# EAGLE schematic lm709_discrete (EAGLE 9.5.2)

## Sheet 1 of 2
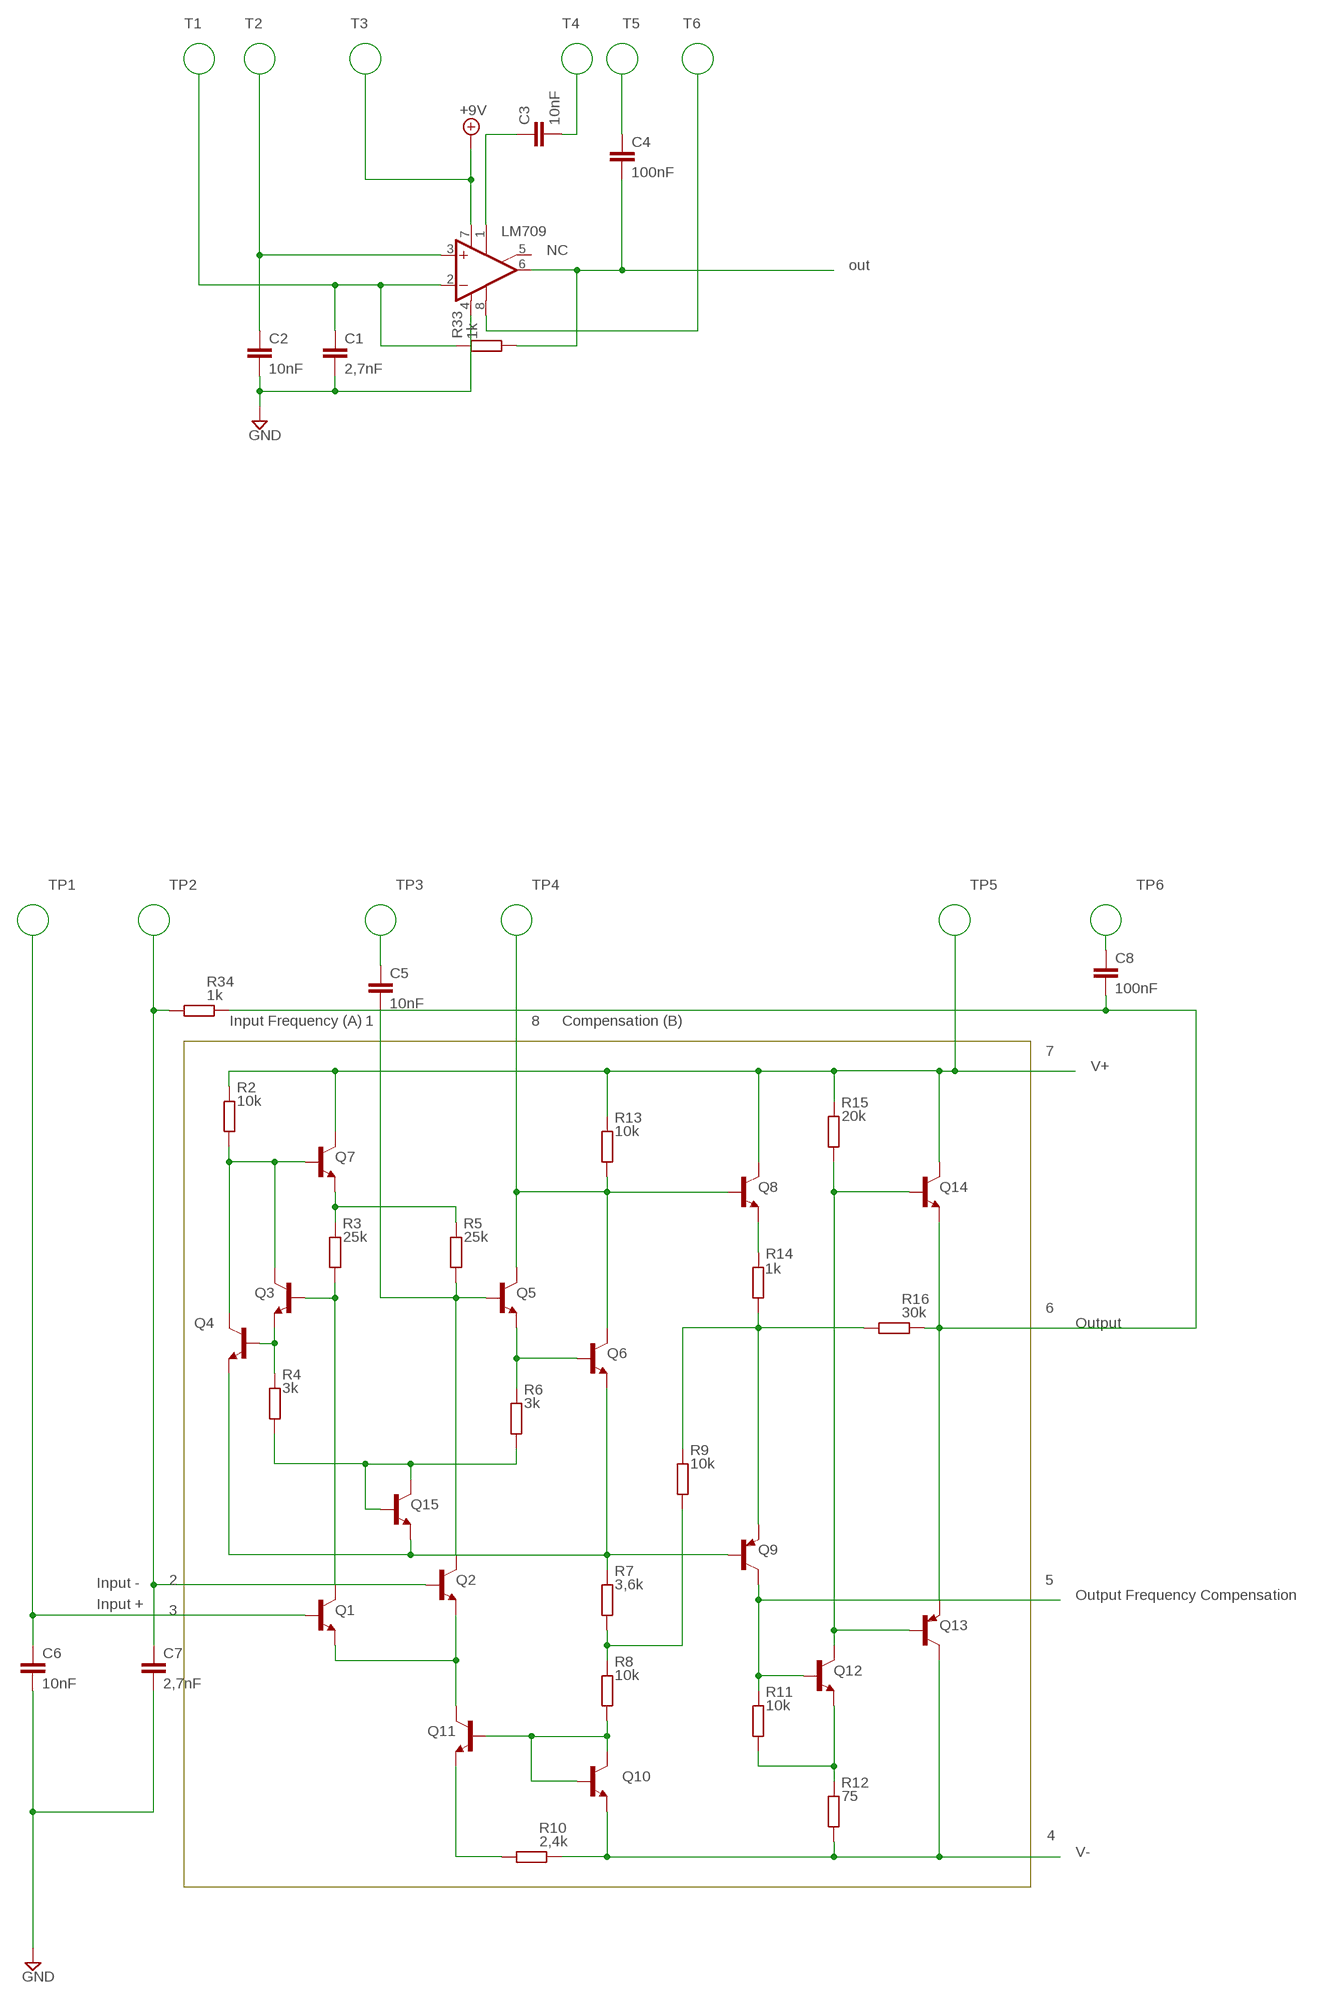
[diagram p0: schematic, sheet 1]

### Parts
C1  2,7nF  C-EU025-024X044  [C025-024X044]
C2  10nF  C-EU025-024X044  [C025-024X044]
C3  10nF  C-EU025-024X044  [C025-024X044]
C4  100nF  C-EU025-024X044  [C025-024X044]
C5  10nF  C-EU025-024X044  [C025-024X044]
C6  10nF  C-EU025-024X044  [C025-024X044]
C7  2,7nF  C-EU025-024X044  [C025-024X044]
C8  100nF  C-EU025-024X044  [C025-024X044]
LM709  LM741P  [DIL08]
Q1  2N3904  [TO92]
Q2  2N3904  [TO92]
Q3  2N3904  [TO92]
Q4  2N3904  [TO92]
Q5  2N3904  [TO92]
Q6  2N3904  [TO92]
Q7  2N3904  [TO92]
Q8  2N3904  [TO92]
Q9  2N3906  [TO92]
Q10  2N3904  [TO92]
Q11  2N3904  [TO92]
Q12  2N3904  [TO92]
Q13  2N3906  [TO92]
Q14  2N3904  [TO92]
Q15  2N3904  [TO92]
R2  10k  R-EU_0207/10  [0207/10]
R3  25k  R-EU_0207/10  [0207/10]
R4  3k  R-EU_0207/10  [0207/10]
R5  25k  R-EU_0207/10  [0207/10]
R6  3k  R-EU_0207/10  [0207/10]
R7  3,6k  R-EU_0207/10  [0207/10]
R8  10k  R-EU_0207/10  [0207/10]
R9  10k  R-EU_0207/10  [0207/10]
R10  2,4k  R-EU_0207/10  [0207/10]
R11  10k  R-EU_0207/10  [0207/10]
R12  75  R-EU_0207/10  [0207/10]
R13  10k  R-EU_0207/10  [0207/10]
R14  1k  R-EU_0207/10  [0207/10]
R15  20k  R-EU_0207/10  [0207/10]
R16  30k  R-EU_0207/10  [0207/10]
R33  1k  R-EU_0207/10  [0207/10]
R34  1k  R-EU_0207/10  [0207/10]

### Nets
+9V: LM709.7(V+)
GND: C1.2 C2.2 C6.2 C7.2 LM709.4(V-)
N$1: Q3.3(E) Q4.2(B) R4.2
N$2: Q1.1(C) Q3.2(B) R3.1
N$3: Q7.3(E) R3.2 R5.2
N$4: Q3.1(C) Q4.1(C) Q7.2(B) R2.1
N$5: Q7.1(C) Q8.1(C) Q14.1(C) R2.2 R13.2 R15.2
N$6: Q5.3(E) Q6.2(B) R6.2
N$7: C5.2 Q2.1(C) Q5.2(B) R5.1
N$8: Q15.1(C) Q15.2(B) R4.1 R6.1
N$9: Q4.3(E) Q6.3(E) Q9.2(B) Q15.3(E) R7.2
N$10: Q12.1(C) Q13.2(B) Q14.2(B) R15.1
N$11: C6.1 Q1.2(B)
N$12: C7.1 Q2.2(B) R34.2
N$13: Q1.3(E) Q2.3(E) Q11.1(C)
N$14: Q11.3(E) R10.2
N$15: Q10.3(E) Q13.1(C) R10.1 R12.2
N$16: Q10.1(C) Q10.2(B) Q11.2(B) R8.1
N$17: R7.1 R8.2 R9.1
N$18: Q5.1(C) Q6.1(C) Q8.2(B) R13.1
N$19: Q9.1(C) Q12.2(B) R11.1
N$20: C8.2 Q13.3(E) Q14.3(E) R16.1 R34.1
N$21: Q9.3(E) R9.2 R14.1 R16.2
N$22: Q8.3(E) R14.2
N$24: Q12.3(E) R11.2 R12.1
N$49: C2.1 LM709.3(+IN)
N$50: C1.1 LM709.2(-IN) R33.2
N$51: C4.2 LM709.6(OUT) R33.1
N$52: C3.1 LM709.1(ON1)
N$53: C3.2
N$54: C4.1
N$55: LM709.8(OPT)
N$56: C5.1
N$57: C8.1
Unconnected: LM709.5(ON2)

### Notes on the sheet
- T1 | T2 | T3 | T4 | T5 | T6
- NC
- out
- TP1 | TP2 | TP3 | TP4 | TP5 | TP6
- Input Frequency (A) | 1 | 8 | Compensation (B)
- 7
- V+
- 6
- Output
- Input - | 2 | 5
- Output Frequency Compensation
- Input +
- 3
- 4
- V-

## Sheet 2 of 2
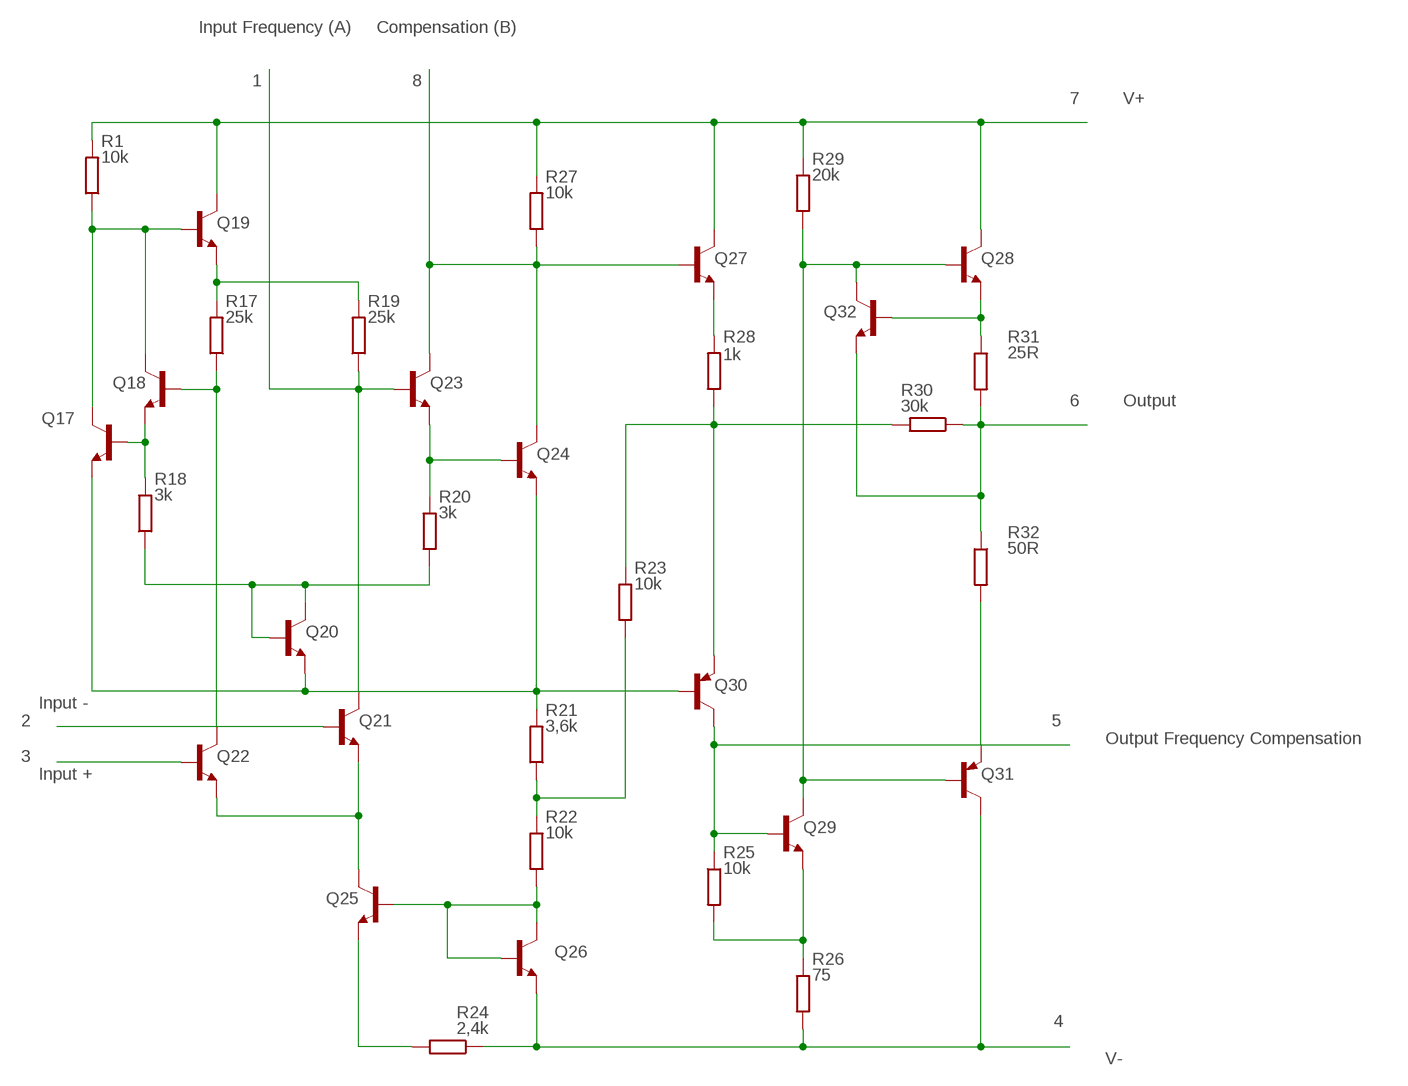
[diagram p1: schematic, sheet 2]

### Parts
Q17  2N3904  [TO92]
Q18  2N3904  [TO92]
Q19  2N3904  [TO92]
Q20  2N3904  [TO92]
Q21  2N3904  [TO92]
Q22  2N3904  [TO92]
Q23  2N3904  [TO92]
Q24  2N3904  [TO92]
Q25  2N3904  [TO92]
Q26  2N3904  [TO92]
Q27  2N3904  [TO92]
Q28  2N3904  [TO92]
Q29  2N3904  [TO92]
Q30  2N3906  [TO92]
Q31  2N3906  [TO92]
Q32  2N3904  [TO92]
R1  10k  R-EU_0207/10  [0207/10]
R17  25k  R-EU_0207/10  [0207/10]
R18  3k  R-EU_0207/10  [0207/10]
R19  25k  R-EU_0207/10  [0207/10]
R20  3k  R-EU_0207/10  [0207/10]
R21  3,6k  R-EU_0207/10  [0207/10]
R22  10k  R-EU_0207/10  [0207/10]
R23  10k  R-EU_0207/10  [0207/10]
R24  2,4k  R-EU_0207/10  [0207/10]
R25  10k  R-EU_0207/10  [0207/10]
R26  75  R-EU_0207/10  [0207/10]
R27  10k  R-EU_0207/10  [0207/10]
R28  1k  R-EU_0207/10  [0207/10]
R29  20k  R-EU_0207/10  [0207/10]
R30  30k  R-EU_0207/10  [0207/10]
R31  25R  R-EU_0207/10  [0207/10]
R32  50R  R-EU_0207/10  [0207/10]

### Nets
N$23: Q17.2(B) Q18.3(E) R18.2
N$25: Q18.2(B) Q22.1(C) R17.1
N$26: Q19.3(E) R17.2 R19.2
N$27: Q17.1(C) Q18.1(C) Q19.2(B) R1.1
N$28: Q19.1(C) Q27.1(C) Q28.1(C) R1.2 R27.2 R29.2
N$29: Q21.1(C) Q23.2(B) R19.1
N$30: Q20.1(C) Q20.2(B) R18.1 R20.1
N$31: Q17.3(E) Q20.3(E) Q24.3(E) Q30.2(B) R21.2
N$32: Q23.3(E) Q24.2(B) R20.2
N$33: Q22.2(B)
N$34: Q21.2(B)
N$35: Q21.3(E) Q22.3(E) Q25.1(C)
N$36: Q25.3(E) R24.2
N$37: Q26.3(E) Q31.1(C) R24.1 R26.2
N$38: Q25.2(B) Q26.1(C) Q26.2(B) R22.1
N$39: R21.1 R22.2 R23.1
N$40: Q23.1(C) Q24.1(C) Q27.2(B) R27.1
N$41: Q28.2(B) Q29.1(C) Q31.2(B) Q32.1(C) R29.1
N$42: Q32.3(E) R30.1 R31.2 R32.1
N$43: Q30.3(E) R23.2 R28.1 R30.2
N$44: Q27.3(E) R28.2
N$45: Q29.2(B) Q30.1(C) R25.1
N$46: Q29.3(E) R25.2 R26.1
N$47: Q28.3(E) Q32.2(B) R31.1
N$48: Q31.3(E) R32.2

### Notes on the sheet
- Input Frequency (A) | Compensation (B)
- 1 | 8
- 7 | V+
- 6 | Output
- Input -
- 2 | 5
- Output Frequency Compensation
- 3
- Input +
- 4
- V-

## Library data of the parts
C1-C8 = rcl:C-EU: CAPACITOR, European symbol; SPICEPREFIX: C
LM709 = linear:*741: OP AMP
Q1-Q8 Q10-Q12 Q14 Q15 Q17-Q29 Q32 = transistor:2N3904: NPN TRANSISTOR
Q9 Q13 Q30 Q31 = transistor-pnp:2N3906: PNP Transistor
R1-R34 = rcl:R-EU_: RESISTOR, European symbol; SPICEPREFIX: R